# EAGLE design HEARING AID (EAGLE 6.5.0)
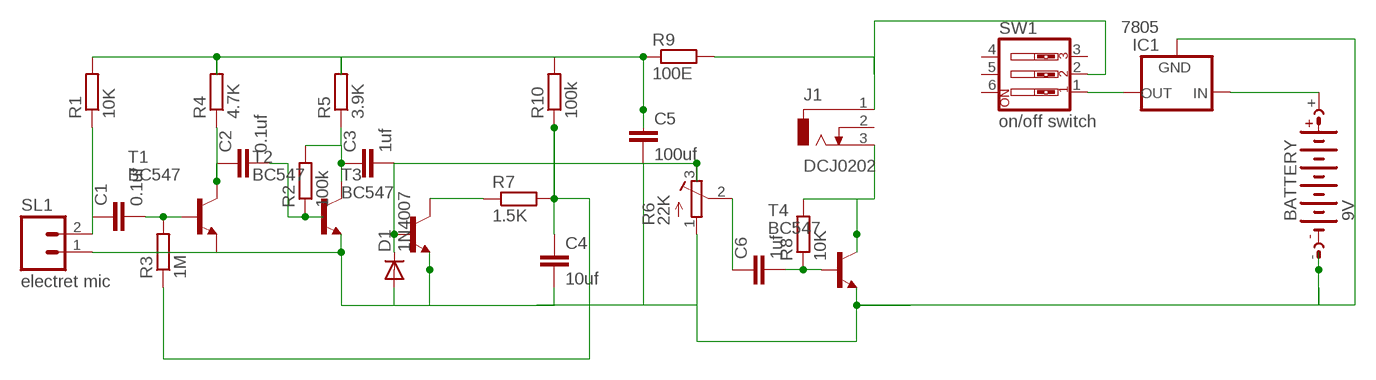
[diagram p0: schematic, sheet 1]

## Parts
BATTERY  9V  AB9V  [AB9V]
C1  0.1uf  C2.5/6  [C2.5-6]
C2  0.1uf  C2.5/6  [C2.5-6]
C3  1uf  C2.5/6  [C2.5-6]
C4  10uf  C2.5/6  [C2.5-6]
C5  100uf  C2.5/6  [C2.5-6]
C6  1uf  C2.5/6  [C2.5-6]
D1  1N4007  1N4004  [DO41-10]
IC1  7805  78XXL  [78XXL]
J1  DCJ0202  [DCJ0202]
R1  10K  R-EU_0204/7  [0204/7]
R2  100k  R-EU_0204/7  [0204/7]
R3  1M  R-EU_0204/7  [0204/7]
R4  4.7K  R-EU_0204/7  [0204/7]
R5  3.9K  R-EU_0204/7  [0204/7]
R6  22K  R-TRIMM64P  [RTRIM64P]
R7  1.5K  R-EU_0204/7  [0204/7]
R8  10K  R-EU_0204/7  [0204/7]
R9  100E  R-EU_0204/7  [0204/7]
R10  100k  R-EU_0204/7  [0204/7]
SL1  electret mic  M02  [02P]
SW1  on/off switch  SW_DIP-3  [EDG-03]
T1  BC547  [TO92]
T2  BC547  [TO92]
T3  BC547  [TO92]
T4  BC547  [TO92]

## Nets
N$1: C1.2 R3.2 T1.2(B)
N$2: C1.1 R1.1 SL1.2
N$3: C2.1 R4.1 T1.3(C)
N$4: C2.2 R2.1 T2.2(B)
N$5: C3.1 R2.2 R5.1 T2.3(C)
N$6: C3.2 D1.C R6.3(A) T3.2(B)
N$7: R7.1 T3.3(C)
N$8: C4.1 R3.1 R7.2 R10.1
N$10: C5.1 R1.2 R4.2 R5.2 R9.1 R10.2
N$12: C6.1 R6.2(S)
N$13: C6.2 R8.1 T4.2(B)
N$14: J1.3 R8.2 T4.3(C)
N$16: BATTERY.+ IC1.IN
N$17: BATTERY.- C4.2 C5.2 D1.A IC1.GND R6.1(E) SL1.1 T1.1(E) T2.1(E) T3.1(E) T4.1(E)
N$18: IC1.OUT SW1.1
N$19: J1.1 R9.2 SW1.2
Unconnected: J1.2 SW1.3 SW1.4 SW1.5 SW1.6

## Library data of the parts
BATTERY = battery:AB9V: 9-V BATTERY CLIP
C1-C6 = capacitor-wima:C: CAPACITOR naming: grid - package width
D1 = diode:1N4004: DIODE general purpose rectifier, 1 A
IC1 = v-reg:78XXL: VOLTAGE REGULATOR
J1 = con-jack:DCJ0202: DC POWER JACK Source: DCJ0202.pdf; OC_FARNELL: unknown; OC_NEWARK: unknown
R1-R5 R7-R10 = rcl:R-EU_: RESISTOR, European symbol
R6 = resistor:R-TRIMM: Trimm resistor
SL1 = con-amp-quick:M02: AMP QUICK CONNECTOR; OC_FARNELL: unknown; OC_NEWARK: unknown
SW1 = special:SW_DIP-3: DIP SWITCH
T1-T4 = transistor:BC547: NPN TRANSISTOR

## Board
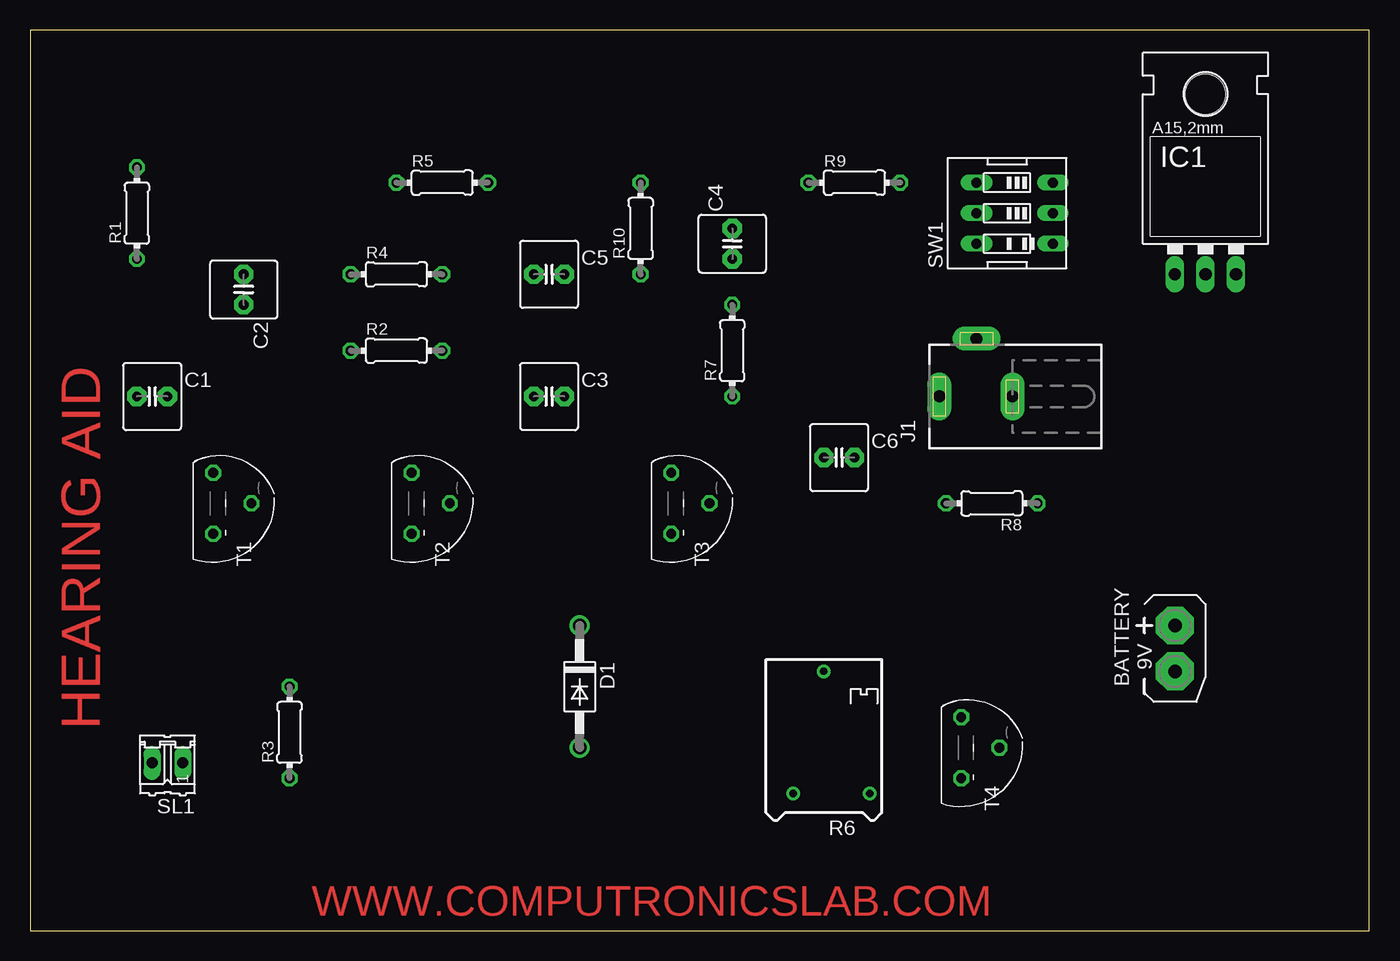
[diagram p1: board, top side]
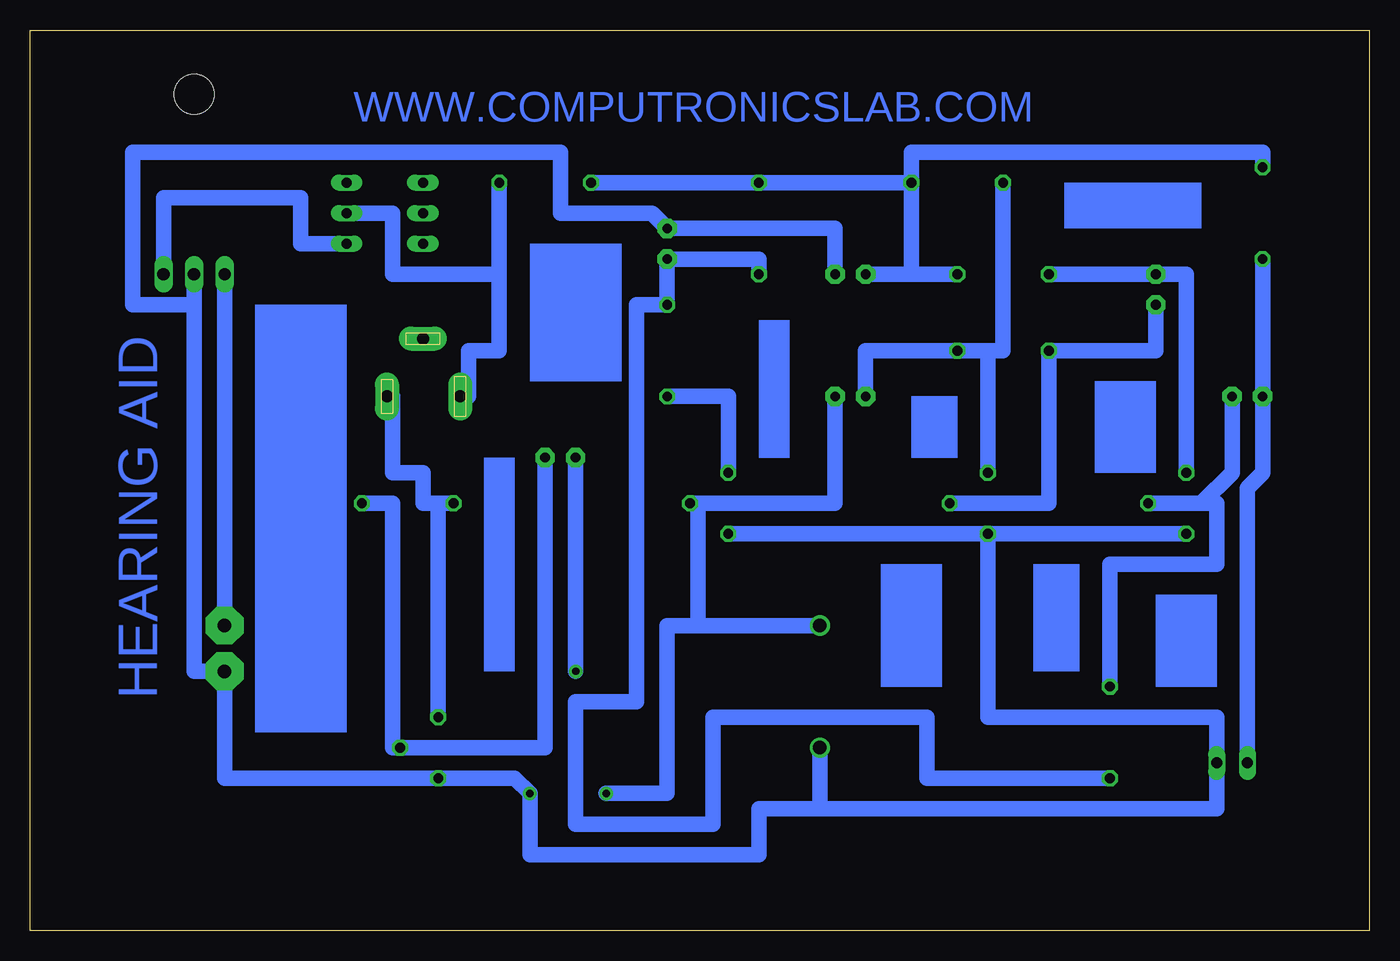
[diagram p2: board, bottom side, seen from below]

Size 111.43 x 74.92 mm. Coordinates in mm from the lower left corner, seen from the top.
Outline: 0,0 111.43,0 111.43,74.92 0,74.92 0,0
Copper layers (1*16): Top 0.035mm / dielectric 1.5mm / Bottom 0.035mm
Design rules "default *": minimum track width 50mil, minimum drill 24mil, track to track 8mil, track to pad 8mil, pad to pad 8mil, via to via 8mil, smd to smd 8mil, copper to edge 40mil, drill to drill 8mil, minimum pad ring 10mil, minimum via ring 8mil, stop-mask expansion 4mil, vias tented up to drill 0mil, thermal gap 10mil

### Footprints (pad centres in the part's own frame; a part is rotated, then mirrored left to right if it is on the bottom)
AB9V = drill 1.118 pad 3.15 octagon: + 0,2.54; - 0,-1.27
C2.5-6 = drill 0.813 pad 1.6 octagon: 1 -1.27,0; 2 1.27,0
DO41-10 = drill 1.118: A 5.08,0; C -5.08,0
78XXL = drill 1.016 long: GND 0,-3.81; IN -2.54,-3.81; OUT 2.54,-3.81 | hole 3.302: 0,11.176
DCJ0202 = drill 1 pad 2 long: 1 0,3.1; 2 4.8,0; 3 0,-3
0204/7 = drill 0.813 octagon: 1 -3.81,0; 2 3.81,0
RTRIM64P = drill 0.61: 1 -2.54,-3.81; 2 7.62,0; 3 -2.54,2.54
02P = drill 0.914 long: 1 -1.27,0; 2 1.27,0
EDG-03 = drill 0.813 long: 1 -2.54,-3.81; 2 0,-3.81; 3 2.54,-3.81; 4 2.54,2.54; 5 0,2.54; 6 -2.54,2.54
TO92 = drill 0.813 octagon: 1 2.54,-1.27; 2 0,1.905; 3 -2.54,-1.27

### Placement (x,y rotation side)
BATTERY  95.25,22.86 0 top
C1  10.16,44.45 0 top
C2  17.78,53.34 270 top
C3  43.18,44.45 0 top
C4  58.42,57.15 90 top
C5  43.18,54.61 0 top
C6  67.31,39.37 0 top
D1  45.72,20.32 270 top
IC1  97.79,58.42 0 top
J1  78.74,44.45 90 top
R1  8.89,59.69 90 top
R2  30.48,48.26 0 top
R3  21.59,16.51 90 top
R4  30.48,54.61 0 top
R5  34.29,62.23 0 top
R6  66.04,13.97 90 top
R7  58.42,48.26 90 top
R8  80.01,35.56 180 top
R9  68.58,62.23 0 top
R10  50.8,58.42 90 top
SL1  11.43,13.97 180 top
SW1  81.28,59.69 90 top
T1  16.51,35.56 270 top
T2  33.02,35.56 270 top
T3  54.61,35.56 270 top
T4  78.74,15.24 270 top

### Tracks (layer width: path | path; a pad name or v marks a point on that pad's centre or on a via)
N$1
  Bottom 1.27: R3.2 21.59,30.48 15.24,30.48 12.7,30.48 12.7,33.02 12.7,35.56 13.97,35.56 | 13.97,35.56 17.78,35.56 T1.2 | C1.2 11.43,38.1 13.97,35.56
N$2
  Bottom 1.27: R1.1 C1.1 8.89,38.1 10.16,36.83 SL1.2
N$3
  Bottom 1.27: T1.3 15.24,54.61 C2.1 R4.1
N$4
  Bottom 1.27: T2.2 34.29,35.56 31.75,35.56 26.67,35.56 26.67,36.83 26.67,40.64 R2.1 21.59,48.26 17.78,48.26 17.78,49.53 C2.2
N$5
  Bottom 1.27: 31.75,48.26 T2.3 | 31.75,48.26 R2.2 38.1,48.26 41.91,48.26 C3.1 | R5.1 30.48,48.26 31.75,48.26
N$6
  Bottom 1.27: 49.53,25.4 58.42,25.4 58.42,11.43 R6.3 | D1.C 49.53,25.4 | 55.88,35.56 55.88,25.4 49.53,25.4 | 55.88,35.56 T3.2 55.88,35.56 | C3.2 44.45,35.56 53.34,35.56 55.88,35.56
N$7
  Bottom 1.27: T3.3 53.34,44.45 R7.1
N$8
  Bottom 1.27: R10.1 50.8,55.88 52.07,55.88 C4.1 R7.2 60.96,52.07 60.96,24.13 60.96,19.05 66.04,19.05 66.04,11.43 66.04,8.89 63.5,8.89 54.61,8.89 54.61,17.78 36.83,17.78 36.83,12.7 R3.1
N$10
  Bottom 1.27: C5.1 38.1,54.61 | 38.1,54.61 R4.2 | 38.1,54.61 R5.2 | R5.2 R10.2 R9.1 | R1.2 8.89,64.77 10.16,64.77 35.56,64.77 38.1,64.77 38.1,63.5 R5.2
N$12
  Bottom 1.27: C6.1 R6.2
N$13
  Bottom 1.27: R8.1 81.28,35.56 81.28,15.24 T4.2 80.01,15.24 68.58,15.24 C6.2
N$14
  Bottom 1.27: 77.47,35.56 T4.3 | R8.2 77.47,35.56 | 77.47,35.56 78.74,35.56 78.74,38.1 81.28,38.1 81.28,44.45 J1.3
N$16
  Bottom 1.27: BATTERY.+ IC1.IN
N$17
  Bottom 1.27: T2.1 T1.1 | T2.1 36.83,33.02 | 36.83,33.02 T3.1 | 36.83,33.02 T2.1 | T2.1 31.75,17.78 21.59,17.78 16.51,17.78 12.7,17.78 SL1.1 12.7,11.43 12.7,10.16 16.51,10.16 50.8,10.16 | 50.8,10.16 50.8,6.35 54.61,6.35 64.77,6.35 69.85,6.35 69.85,7.62 R6.1 71.12,12.7 T4.1 86.36,12.7 95.25,12.7 BATTERY.- 97.79,21.59 97.79,52.07 | 50.8,10.16 45.72,10.16 D1.A | C5.2 44.45,57.15 44.45,58.42 48.26,58.42 C4.2 59.69,59.69 67.31,59.69 67.31,64.77 72.39,64.77 93.98,64.77 102.87,64.77 102.87,60.96 102.87,55.88 102.87,52.07 97.79,52.07 | 97.79,52.07 IC1.GND
N$18
  Bottom 1.27: SW1.1 88.9,57.15 88.9,60.96 100.33,60.96 IC1.OUT 100.33,55.88
N$19
  Bottom 1.27: 72.39,54.61 72.39,48.26 74.93,48.26 74.93,44.45 J1.1 | 72.39,54.61 R9.2 | SW1.2 83.82,59.69 81.28,59.69 81.28,57.15 81.28,54.61 72.39,54.61
(copper drawn outside any net)
  shapes: Bottom area x10

### Text on the board
Top: HEARING AID | WWW.COMPUTRONICSLAB.COM
Bottom: WWW.COMPUTRONICSLAB.COM | HEARING AID